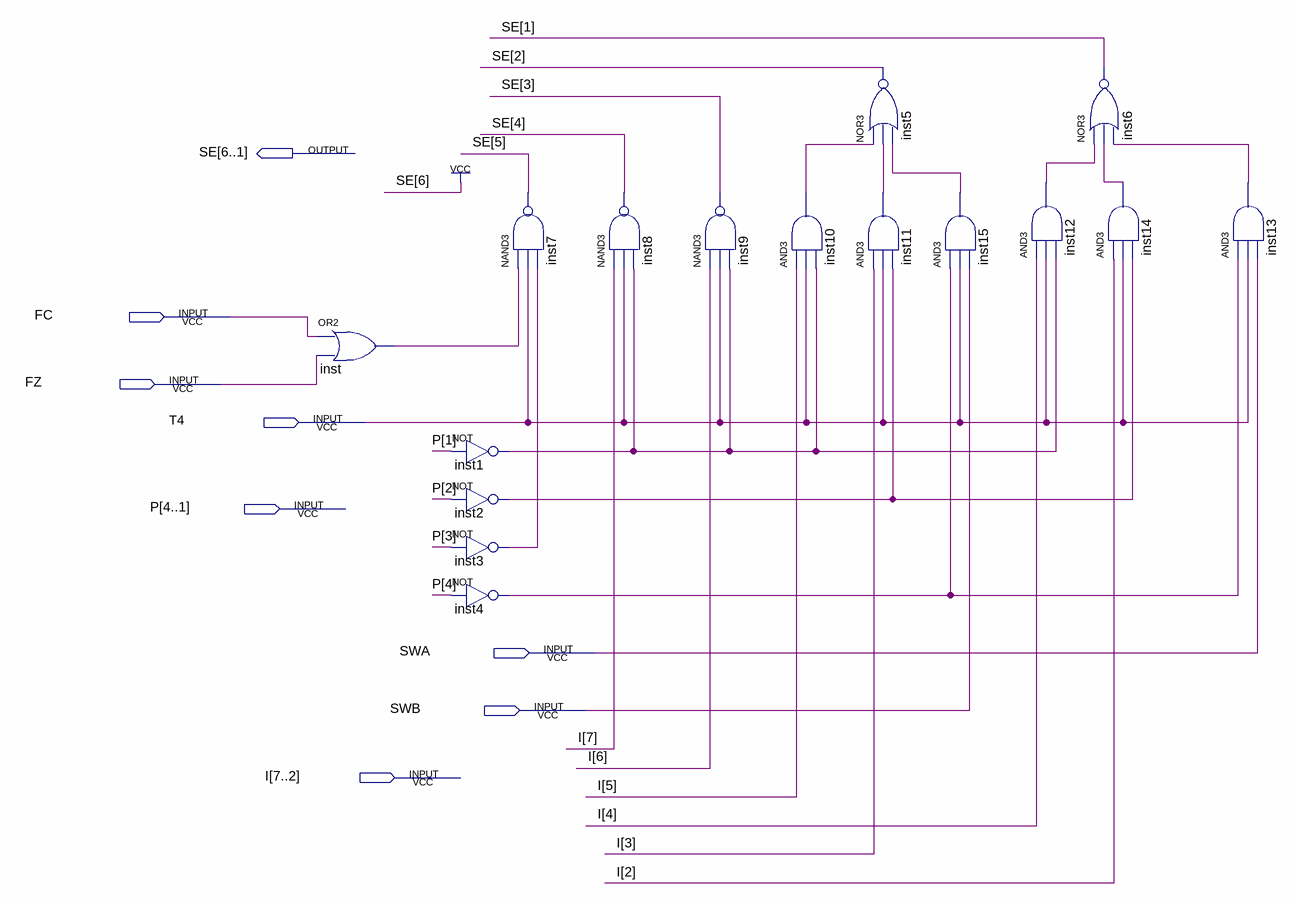
[diagram p0: schematic sheet]
// Quartus schematic task6.bdf as structural Verilog: 16 symbols, 8 pins
module task6 (
  input  FC,
  input  FZ,
  input  T4,
  input  [4:1] P,
  input  SWA,
  input  SWB,
  input  [7:2] I,
  output [6:1] SE
);

  wire inst1_out, inst2_out, inst3_out, inst4_out, inst10_out, inst11_out, inst12_out, inst13_out,
       inst14_out, inst15_out, inst_out;

  or inst (inst_out, FC, FZ);
  nand inst7 (SE[5], inst_out, T4, inst3_out);
  not inst1 (inst1_out, P[1]);
  not inst2 (inst2_out, P[2]);
  not inst3 (inst3_out, P[3]);
  not inst4 (inst4_out, P[4]);
  nand inst8 (SE[4], I[7], T4, inst1_out);
  nand inst9 (SE[3], I[6], T4, inst1_out);
  and inst10 (inst10_out, I[5], T4, inst1_out);
  nor inst5 (SE[2], inst10_out, inst11_out, inst15_out);
  and inst11 (inst11_out, I[3], T4, inst2_out);
  and inst15 (inst15_out, inst4_out, T4, SWB);
  and inst12 (inst12_out, I[4], T4, inst1_out);
  nor inst6 (SE[1], inst12_out, inst14_out, inst13_out);
  and inst14 (inst14_out, I[2], T4, inst2_out);
  and inst13 (inst13_out, inst4_out, T4, SWA);

  assign SE[6] = 1'b1;
endmodule
